# Altium schematic sheet （1）.SchDoc
size A4
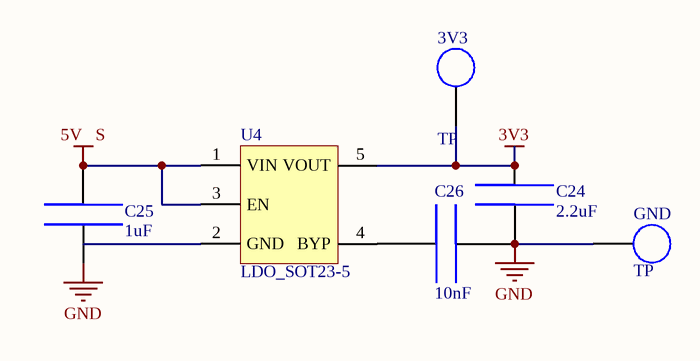
[diagram p0: （1）.SchDoc]

## Parts
3V3  TP
C24  2.2uF
C25  1uF
C26  10nF
GND  TP
U4  LDO_SOT23-5  [SOT-23 L]

## Nets
3V3: 3V3.1 C24.2 U4.5(VOUT)
5V   S: C25.2 U4.1(VIN) U4.3(EN)
GND: C24.1 C25.1 C26.2 GND.1
NetC26_1: C26.1 U4.4(BYP)

Not connected (* = marked no-connect by the designer): U4 2(GND)

## Library data of the parts
3V3 = ?
C24 = CAP2: 电容2
C25 = CAP1: 电容1
C26 = CAP3: 电容3
GND = !